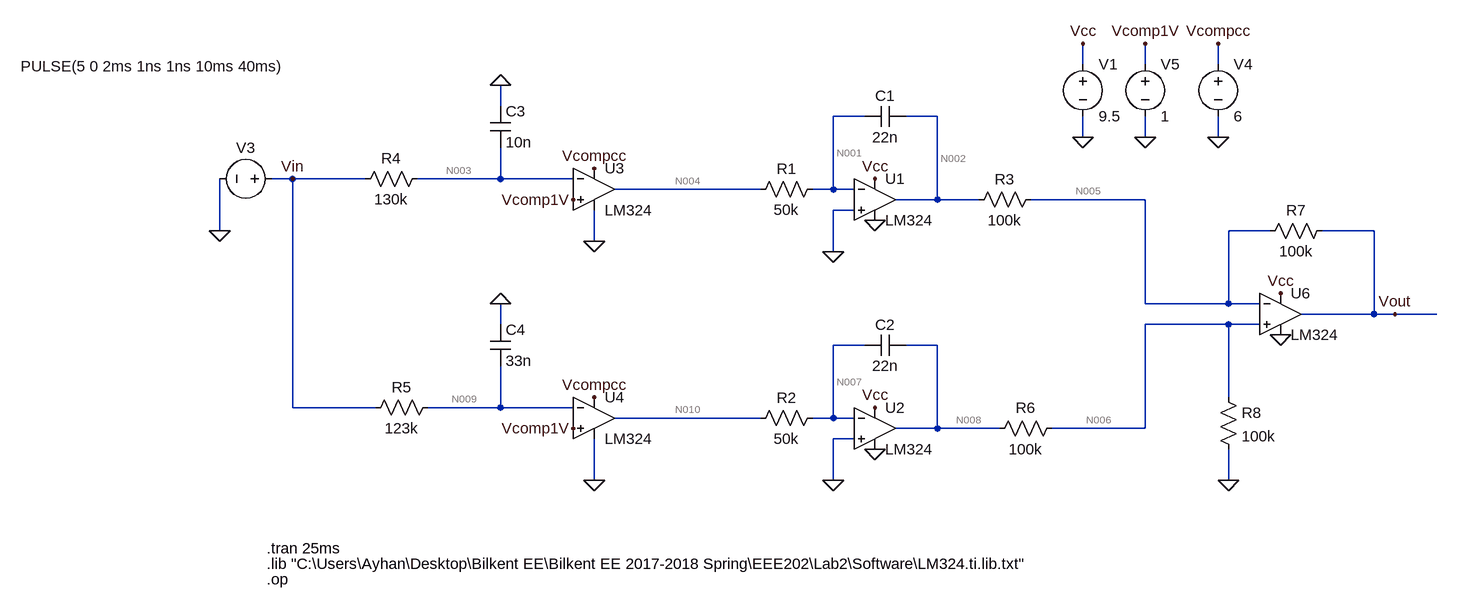
[diagram p0: schematic SoftwareLab2.asc]
SoftwareLab2.asc, the LTspice schematic file:
Version 4
SHEET 1 1764 680
WIRE 992 -560 992 -592
WIRE 1088 -560 1088 -592
WIRE 1200 -560 1200 -592
WIRE 96 -496 96 -528
WIRE 656 -480 608 -480
WIRE 768 -480 720 -480
WIRE 992 -448 992 -480
WIRE 1088 -448 1088 -480
WIRE 1200 -448 1200 -480
WIRE -224 -384 -256 -384
WIRE -112 -384 -224 -384
WIRE 96 -384 96 -432
WIRE 96 -384 -32 -384
WIRE 208 -384 96 -384
WIRE 496 -368 272 -368
WIRE 608 -368 608 -480
WIRE 608 -368 576 -368
WIRE 640 -368 608 -368
WIRE 768 -352 768 -480
WIRE 768 -352 704 -352
WIRE 832 -352 768 -352
WIRE 1088 -352 912 -352
WIRE 640 -336 608 -336
WIRE -336 -304 -336 -384
WIRE 1280 -304 1216 -304
WIRE 1440 -304 1360 -304
WIRE 240 -288 240 -336
WIRE 608 -272 608 -336
WIRE 1088 -192 1088 -352
WIRE 1216 -192 1216 -304
WIRE 1216 -192 1088 -192
WIRE 1264 -192 1216 -192
WIRE 1440 -176 1440 -304
WIRE 1440 -176 1328 -176
WIRE 1472 -176 1440 -176
WIRE 1536 -176 1472 -176
WIRE 96 -160 96 -192
WIRE 1216 -160 1088 -160
WIRE 1264 -160 1216 -160
WIRE 656 -128 608 -128
WIRE 768 -128 720 -128
WIRE 1216 -48 1216 -160
WIRE -224 -32 -224 -384
WIRE -96 -32 -224 -32
WIRE 96 -32 96 -96
WIRE 96 -32 -16 -32
WIRE 208 -32 96 -32
WIRE 496 -16 272 -16
WIRE 608 -16 608 -128
WIRE 608 -16 576 -16
WIRE 640 -16 608 -16
WIRE 768 0 768 -128
WIRE 768 0 704 0
WIRE 864 0 768 0
WIRE 1088 0 1088 -160
WIRE 1088 0 944 0
WIRE 640 16 608 16
WIRE 240 80 240 16
WIRE 608 80 608 16
WIRE 1216 80 1216 32
FLAG 992 -592 Vcc
FLAG 672 -384 Vcc
FLAG 608 -272 0
FLAG -336 -304 0
FLAG 672 -32 Vcc
FLAG 608 80 0
FLAG 1200 -592 Vcompcc
FLAG 240 -400 Vcompcc
FLAG 240 -48 Vcompcc
FLAG 240 -288 0
FLAG 240 80 0
FLAG 1200 -448 0
FLAG 1088 -592 Vcomp1V
FLAG 1088 -448 0
FLAG 208 -352 Vcomp1V
FLAG 208 0 Vcomp1V
FLAG 96 -528 0
FLAG 96 -192 0
FLAG 1296 -208 Vcc
FLAG 1216 80 0
FLAG 1472 -176 Vout
FLAG -224 -384 Vin
FLAG 992 -448 0
FLAG 672 -320 0
FLAG 672 32 0
FLAG 1296 -144 0
SYMBOL Opamps\\opamp2 672 -416 R0
SYMATTR InstName U1
SYMATTR Value LM324
SYMBOL voltage 992 -576 R0
WINDOW 123 0 0 Left 2
WINDOW 39 0 0 Left 2
SYMATTR InstName V1
SYMATTR Value 9.5
SYMBOL cap 720 -496 R90
WINDOW 0 0 32 VBottom 2
WINDOW 3 32 32 VTop 2
SYMATTR InstName C1
SYMATTR Value 22n
SYMBOL res 592 -384 R90
WINDOW 0 0 56 VBottom 2
WINDOW 3 32 56 VTop 2
SYMATTR InstName R1
SYMATTR Value 50k
SYMBOL Opamps\\opamp2 672 -64 R0
SYMATTR InstName U2
SYMATTR Value LM324
SYMBOL cap 720 -144 R90
WINDOW 0 0 32 VBottom 2
WINDOW 3 32 32 VTop 2
SYMATTR InstName C2
SYMATTR Value 22n
SYMBOL res 592 -32 R90
WINDOW 0 0 56 VBottom 2
WINDOW 3 32 56 VTop 2
SYMATTR InstName R2
SYMATTR Value 50k
SYMBOL Opamps\\opamp2 240 -432 R0
SYMATTR InstName U3
SYMATTR Value LM324
SYMBOL res 928 -368 R90
WINDOW 0 0 56 VBottom 2
WINDOW 3 32 56 VTop 2
SYMATTR InstName R3
SYMATTR Value 100k
SYMBOL voltage 1200 -576 R0
WINDOW 123 0 0 Left 2
WINDOW 39 0 0 Left 2
SYMATTR InstName V4
SYMATTR Value 6
SYMBOL Opamps\\opamp2 240 -80 R0
SYMATTR InstName U4
SYMATTR Value LM324
SYMBOL voltage 1088 -576 R0
WINDOW 123 0 0 Left 2
WINDOW 39 0 0 Left 2
SYMATTR InstName V5
SYMATTR Value 1
SYMBOL cap 80 -496 R0
SYMATTR InstName C3
SYMATTR Value 10n
SYMBOL cap 80 -160 R0
SYMATTR InstName C4
SYMATTR Value 33n
SYMBOL res -16 -400 R90
WINDOW 0 0 56 VBottom 2
WINDOW 3 32 56 VTop 2
SYMATTR InstName R4
SYMATTR Value 130k
SYMBOL res 0 -48 R90
WINDOW 0 0 56 VBottom 2
WINDOW 3 32 56 VTop 2
SYMATTR InstName R5
SYMATTR Value 123k
SYMBOL res 960 -16 R90
WINDOW 0 0 56 VBottom 2
WINDOW 3 32 56 VTop 2
SYMATTR InstName R6
SYMATTR Value 100k
SYMBOL Opamps\\opamp2 1296 -240 R0
SYMATTR InstName U6
SYMATTR Value LM324
SYMBOL res 1376 -320 R90
WINDOW 0 0 56 VBottom 2
WINDOW 3 32 56 VTop 2
SYMATTR InstName R7
SYMATTR Value 100k
SYMBOL res 1200 -64 R0
SYMATTR InstName R8
SYMATTR Value 100k
SYMBOL voltage -240 -384 R90
WINDOW 0 -32 56 VBottom 2
WINDOW 3 -189 200 VTop 2
WINDOW 123 0 0 Left 2
WINDOW 39 0 0 Left 2
SYMATTR InstName V3
SYMATTR Value PULSE(5 0 2ms 1ns 1ns 10ms 40ms)
TEXT -264 208 Left 2 !.lib "C:\\Users\\Ayhan\\Desktop\\Bilkent EE\\Bilkent EE 2017-2018 Spring\\EEE202\\Lab2\\Software\\LM324.ti.lib.txt"
TEXT -264 184 Left 2 !.tran 25ms
TEXT -264 232 Left 2 !.op

The netlist it stands for:
* SoftwareLab2.asc
XU1 0 N001 Vcc 0 N002 LM324  ; pins In+ In- V+ V- OUT
V1 Vcc 0 9.5
C1 N002 N001 22n
R1 N001 N004 50k
XU2 0 N007 Vcc 0 N008 LM324  ; pins In+ In- V+ V- OUT
C2 N008 N007 22n
R2 N007 N010 50k
XU3 Vcomp1V N003 Vcompcc 0 N004 LM324  ; pins In+ In- V+ V- OUT
R3 N005 N002 100k
V4 Vcompcc 0 6
XU4 Vcomp1V N009 Vcompcc 0 N010 LM324  ; pins In+ In- V+ V- OUT
V5 Vcomp1V 0 1
C3 0 N003 10n
C4 0 N009 33n
R4 N003 Vin 130k
R5 N009 Vin 123k
R6 N006 N008 100k
XU6 N006 N005 Vcc 0 Vout LM324  ; pins In+ In- V+ V- OUT
R7 Vout N005 100k
R8 N006 0 100k
V3 Vin 0 PULSE(5 0 2ms 1ns 1ns 10ms 40ms)
.lib "C:\Users\Ayhan\Desktop\Bilkent EE\Bilkent EE 2017-2018 Spring\EEE202\Lab2\Software\LM324.ti.lib.txt"
.tran 25ms
.op
.backanno
.end

* Results of the author's LTspice run, read from the files saved beside the schematic
* Operating Point, zero values left out:
*   V(n001) = -74.63 mV
*   V(vcc) = 9.5 V
*   V(n002) = 8.015 V
*   V(n004) = -84.66 mV
*   V(n007) = -74.63 mV
*   V(n008) = 8.015 V
*   V(n010) = -84.66 mV
*   V(n003) = 4.756 V
*   V(vcomp1v) = 1 V
*   V(vcompcc) = 6 V
*   V(n005) = 4.014 V
*   V(n009) = 4.768 V
*   V(vin) = 5 V
*   V(n006) = 4.012 V
*   V(vout) = 5.119 mV
*   I(R8) = 40.12 µA
*   I(R7) = -40.09 µA
*   I(R6) = -40.03 µA
*   I(R5) = -1.884 µA
*   I(R4) = -1.878 µA
*   I(R3) = -40 µA
*   I(R2) = 200.6 nA
*   I(R1) = 200.6 nA
*   I(V3) = -3.762 µA
*   I(V5) = 4.093 µA
*   I(V4) = 585.2 µA
*   I(V1) = 862.5 µA
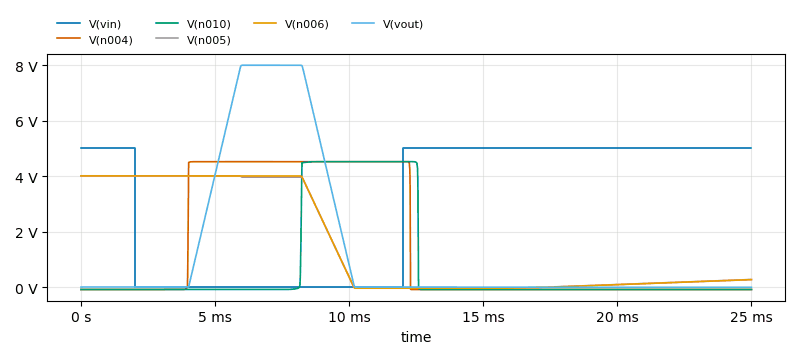
[diagram p1: Transient Analysis of SoftwareLab2.asc, plotted from the saved traces]
* Transient Analysis, 1 run:
*   V(vin): min 0 V, max 5 V, average 3 V, rms 3.873 V, last 5 V
*   V(n004): min -84.66 mV, max 4.525 V, average 1.443 V, rms 2.603 V, last -84.64 mV
*   V(n010): min -84.66 mV, max 4.524 V, average 720.1 mV, rms 1.887 V, last -84.64 mV
*   V(n005): min -35.55 mV, max 4.014 V, average 1.505 V, rms 2.387 V, last 276.3 mV
*   V(n006): min -38.51 mV, max 4.012 V, average 1.507 V, rms 2.392 V, last 272 mV
*   V(vout): min -4.299 mV, max 8.002 V, average 1.356 V, rms 3.037 V, last -4.299 mV